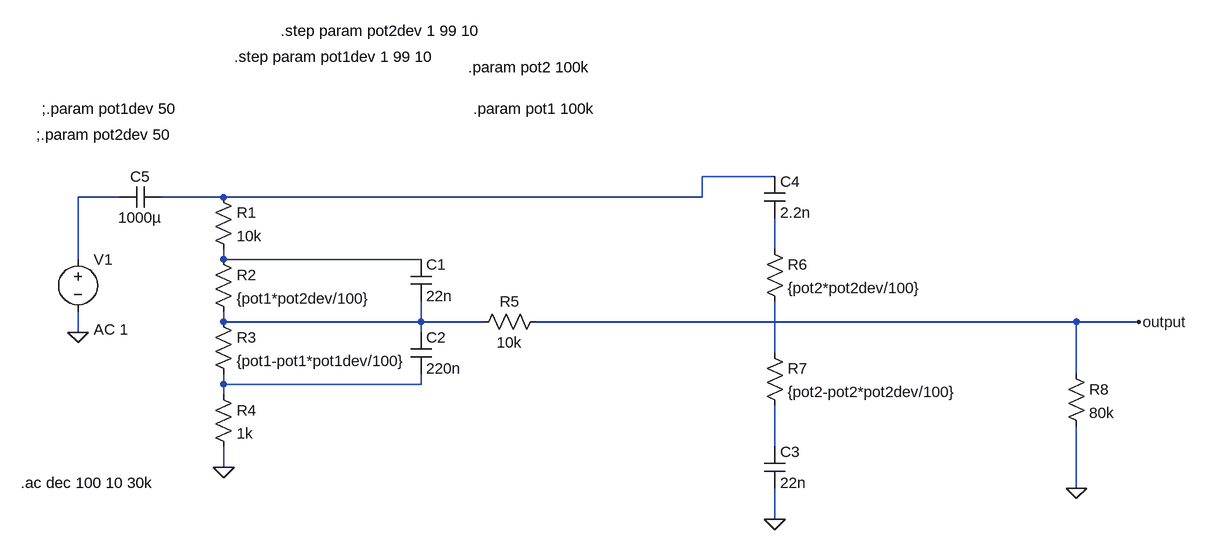
[diagram p0: schematic ep2 img3.asc]
ep2 img3.asc, the LTspice schematic file:
Version 4
SHEET 1 1648 680
WIRE 992 16 880 16
WIRE -16 48 -80 48
WIRE 144 48 48 48
WIRE 880 48 880 16
WIRE 880 48 144 48
WIRE 992 128 992 80
WIRE -80 144 -80 48
WIRE 144 144 144 128
WIRE 448 144 144 144
WIRE 144 240 144 224
WIRE 448 240 448 208
WIRE 448 240 144 240
WIRE 544 240 448 240
WIRE 1456 240 624 240
WIRE 1552 240 1456 240
WIRE -80 256 -80 224
WIRE 448 256 448 240
WIRE 992 288 992 208
WIRE 1456 320 1456 240
WIRE 144 336 144 320
WIRE 448 336 448 320
WIRE 448 336 144 336
WIRE 144 352 144 336
WIRE 992 432 992 368
WIRE 144 464 144 432
WIRE 1456 496 1456 400
WIRE 992 544 992 496
FLAG -80 256 0
FLAG 144 464 0
FLAG 992 544 0
FLAG 1456 496 0
FLAG 1552 240 output
SYMBOL voltage -80 128 R0
WINDOW 123 24 124 Left 2
WINDOW 39 0 0 Left 0
SYMATTR InstName V1
SYMATTR Value ""
SYMATTR Value2 AC 1
SYMBOL res 128 32 R0
SYMATTR InstName R1
SYMATTR Value 10k
SYMBOL res 128 128 R0
SYMATTR InstName R2
SYMATTR Value {pot1*pot2dev/100}
SYMBOL res 128 224 R0
SYMATTR InstName R3
SYMATTR Value {pot1-pot1*pot1dev/100}
SYMBOL res 128 336 R0
SYMATTR InstName R4
SYMATTR Value 1k
SYMBOL cap 432 144 R0
SYMATTR InstName C1
SYMATTR Value 22n
SYMBOL cap 432 256 R0
SYMATTR InstName C2
SYMATTR Value 220n
SYMBOL res 640 224 R90
WINDOW 0 0 56 VBottom 2
WINDOW 3 32 56 VTop 2
SYMATTR InstName R5
SYMATTR Value 10k
SYMBOL res 976 112 R0
SYMATTR InstName R6
SYMATTR Value {pot2*pot2dev/100}
SYMBOL res 976 272 R0
SYMATTR InstName R7
SYMATTR Value {pot2-pot2*pot2dev/100}
SYMBOL cap 976 432 R0
SYMATTR InstName C3
SYMATTR Value 22n
SYMBOL cap 976 16 R0
SYMATTR InstName C4
SYMATTR Value 2.2n
SYMBOL cap -16 64 R270
WINDOW 0 32 32 VTop 2
WINDOW 3 0 32 VBottom 2
SYMATTR InstName C5
SYMATTR Value 1000µ
SYMBOL res 1440 304 R0
SYMATTR InstName R8
SYMATTR Value 80k
TEXT -136 -88 Left 2 !;.param pot1dev 50
TEXT -144 -48 Left 2 !;.param pot2dev 50
TEXT 520 -152 Left 2 !.param pot2 100k
TEXT 528 -88 Left 2 !.param pot1 100k
TEXT -168 488 Left 2 !.ac dec 100 10 30k
TEXT 232 -208 Left 2 !.step param pot2dev 1 99 10
TEXT 160 -168 Left 2 !.step param pot1dev 1 99 10

The netlist it stands for:
* ep2 img3.asc
V1 N002 0 AC 1
R1 N001 N004 10k
R2 N004 N005 {pot1*pot2dev/100}
R3 N005 N007 {pot1-pot1*pot1dev/100}
R4 N007 0 1k
C1 N004 N005 22n
C2 N005 N007 220n
R5 output N005 10k
R6 N003 N006 {pot2*pot2dev/100}
R7 N006 N008 {pot2-pot2*pot2dev/100}
C3 N008 0 22n
C4 N001 N003 2.2n
C5 N002 N001 1000µ
R8 output 0 80k
;.param pot1dev 50
;.param pot2dev 50
.param pot2 100k
.param pot1 100k
.ac dec 100 10 30k
.step param pot2dev 1 99 10
.step param pot1dev 1 99 10
.backanno
.end